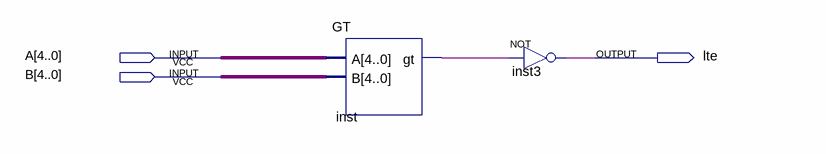
[diagram p0: schematic sheet]
// Quartus schematic LTE.bdf as structural Verilog: 2 symbols, 3 pins
module LTE (
  input  [4:0] A,
  input  [4:0] B,
  output lte
);

  wire inst_gt;

  GT inst (.A(A), .B(B), .gt(inst_gt));
  not inst3 (lte, inst_gt);
endmodule
